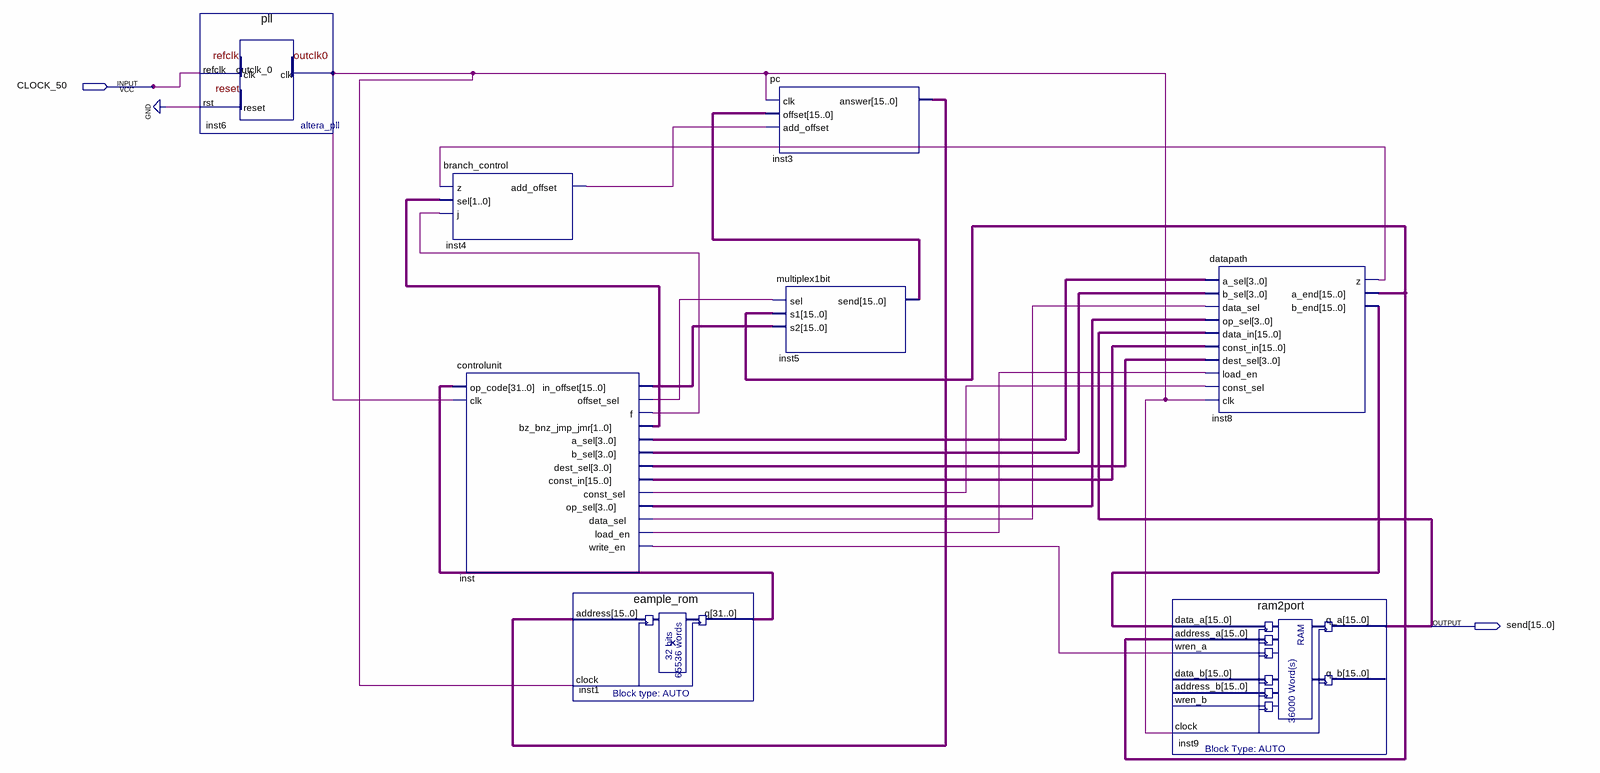
[diagram p0: schematic sheet]
// Quartus schematic vseochenploxo.bdf as structural Verilog: 8 symbols, 2 pins
module vseochenploxo (
  input  CLOCK_50,
  output [15:0] send
);

  wire inst4_add_offset, inst6_outclk_0, inst8_z, inst_const_sel, inst_data_sel, inst_f, inst_load_en,
       inst_offset_sel, inst_write_en;
  wire [1:0] inst_bz_bnz_jmp_jmr;
  wire [3:0] inst_a_sel, inst_b_sel, inst_dest_sel, inst_op_sel;
  wire [15:0] inst3_answer, inst5_send, inst8_a_end, inst8_b_end, inst_const_in, inst_in_offset;
  wire [31:0] inst1_q;

  pll inst6 (.refclk(CLOCK_50), .rst(1'b0), .outclk_0(inst6_outclk_0));
  branch_control inst4 (.z(inst8_z), .sel(inst_bz_bnz_jmp_jmr), .j(inst_f), .add_offset(inst4_add_offset));
  controlunit inst (
    .op_code(inst1_q), .clk(inst6_outclk_0), .in_offset(inst_in_offset), .offset_sel(inst_offset_sel),
    .f(inst_f), .bz_bnz_jmp_jmr(inst_bz_bnz_jmp_jmr), .a_sel(inst_a_sel), .b_sel(inst_b_sel),
    .dest_sel(inst_dest_sel), .const_in(inst_const_in), .const_sel(inst_const_sel), .op_sel(inst_op_sel),
    .data_sel(inst_data_sel), .load_en(inst_load_en), .write_en(inst_write_en));
  eample_rom inst1 (.address(inst3_answer), .clock(inst6_outclk_0), .q(inst1_q));
  pc inst3 (.clk(inst6_outclk_0), .offset(inst5_send), .add_offset(inst4_add_offset), .answer(inst3_answer));
  multiplex1bit inst5 (.sel(inst_offset_sel), .s1(inst8_a_end), .s2(inst_in_offset), .send(inst5_send));
  ram2port inst9 (
    .data_a(inst8_b_end), .address_a(inst8_a_end), .wren_a(inst_write_en), .clock(inst6_outclk_0), .q_a(send));  // open: data_b, address_b, wren_b, q_b
  datapath inst8 (
    .a_sel(inst_a_sel), .b_sel(inst_b_sel), .data_sel(inst_data_sel), .op_sel(inst_op_sel), .data_in(send),
    .const_in(inst_const_in), .dest_sel(inst_dest_sel), .load_en(inst_load_en), .const_sel(inst_const_sel),
    .clk(inst6_outclk_0), .z(inst8_z), .a_end(inst8_a_end), .b_end(inst8_b_end));
endmodule
